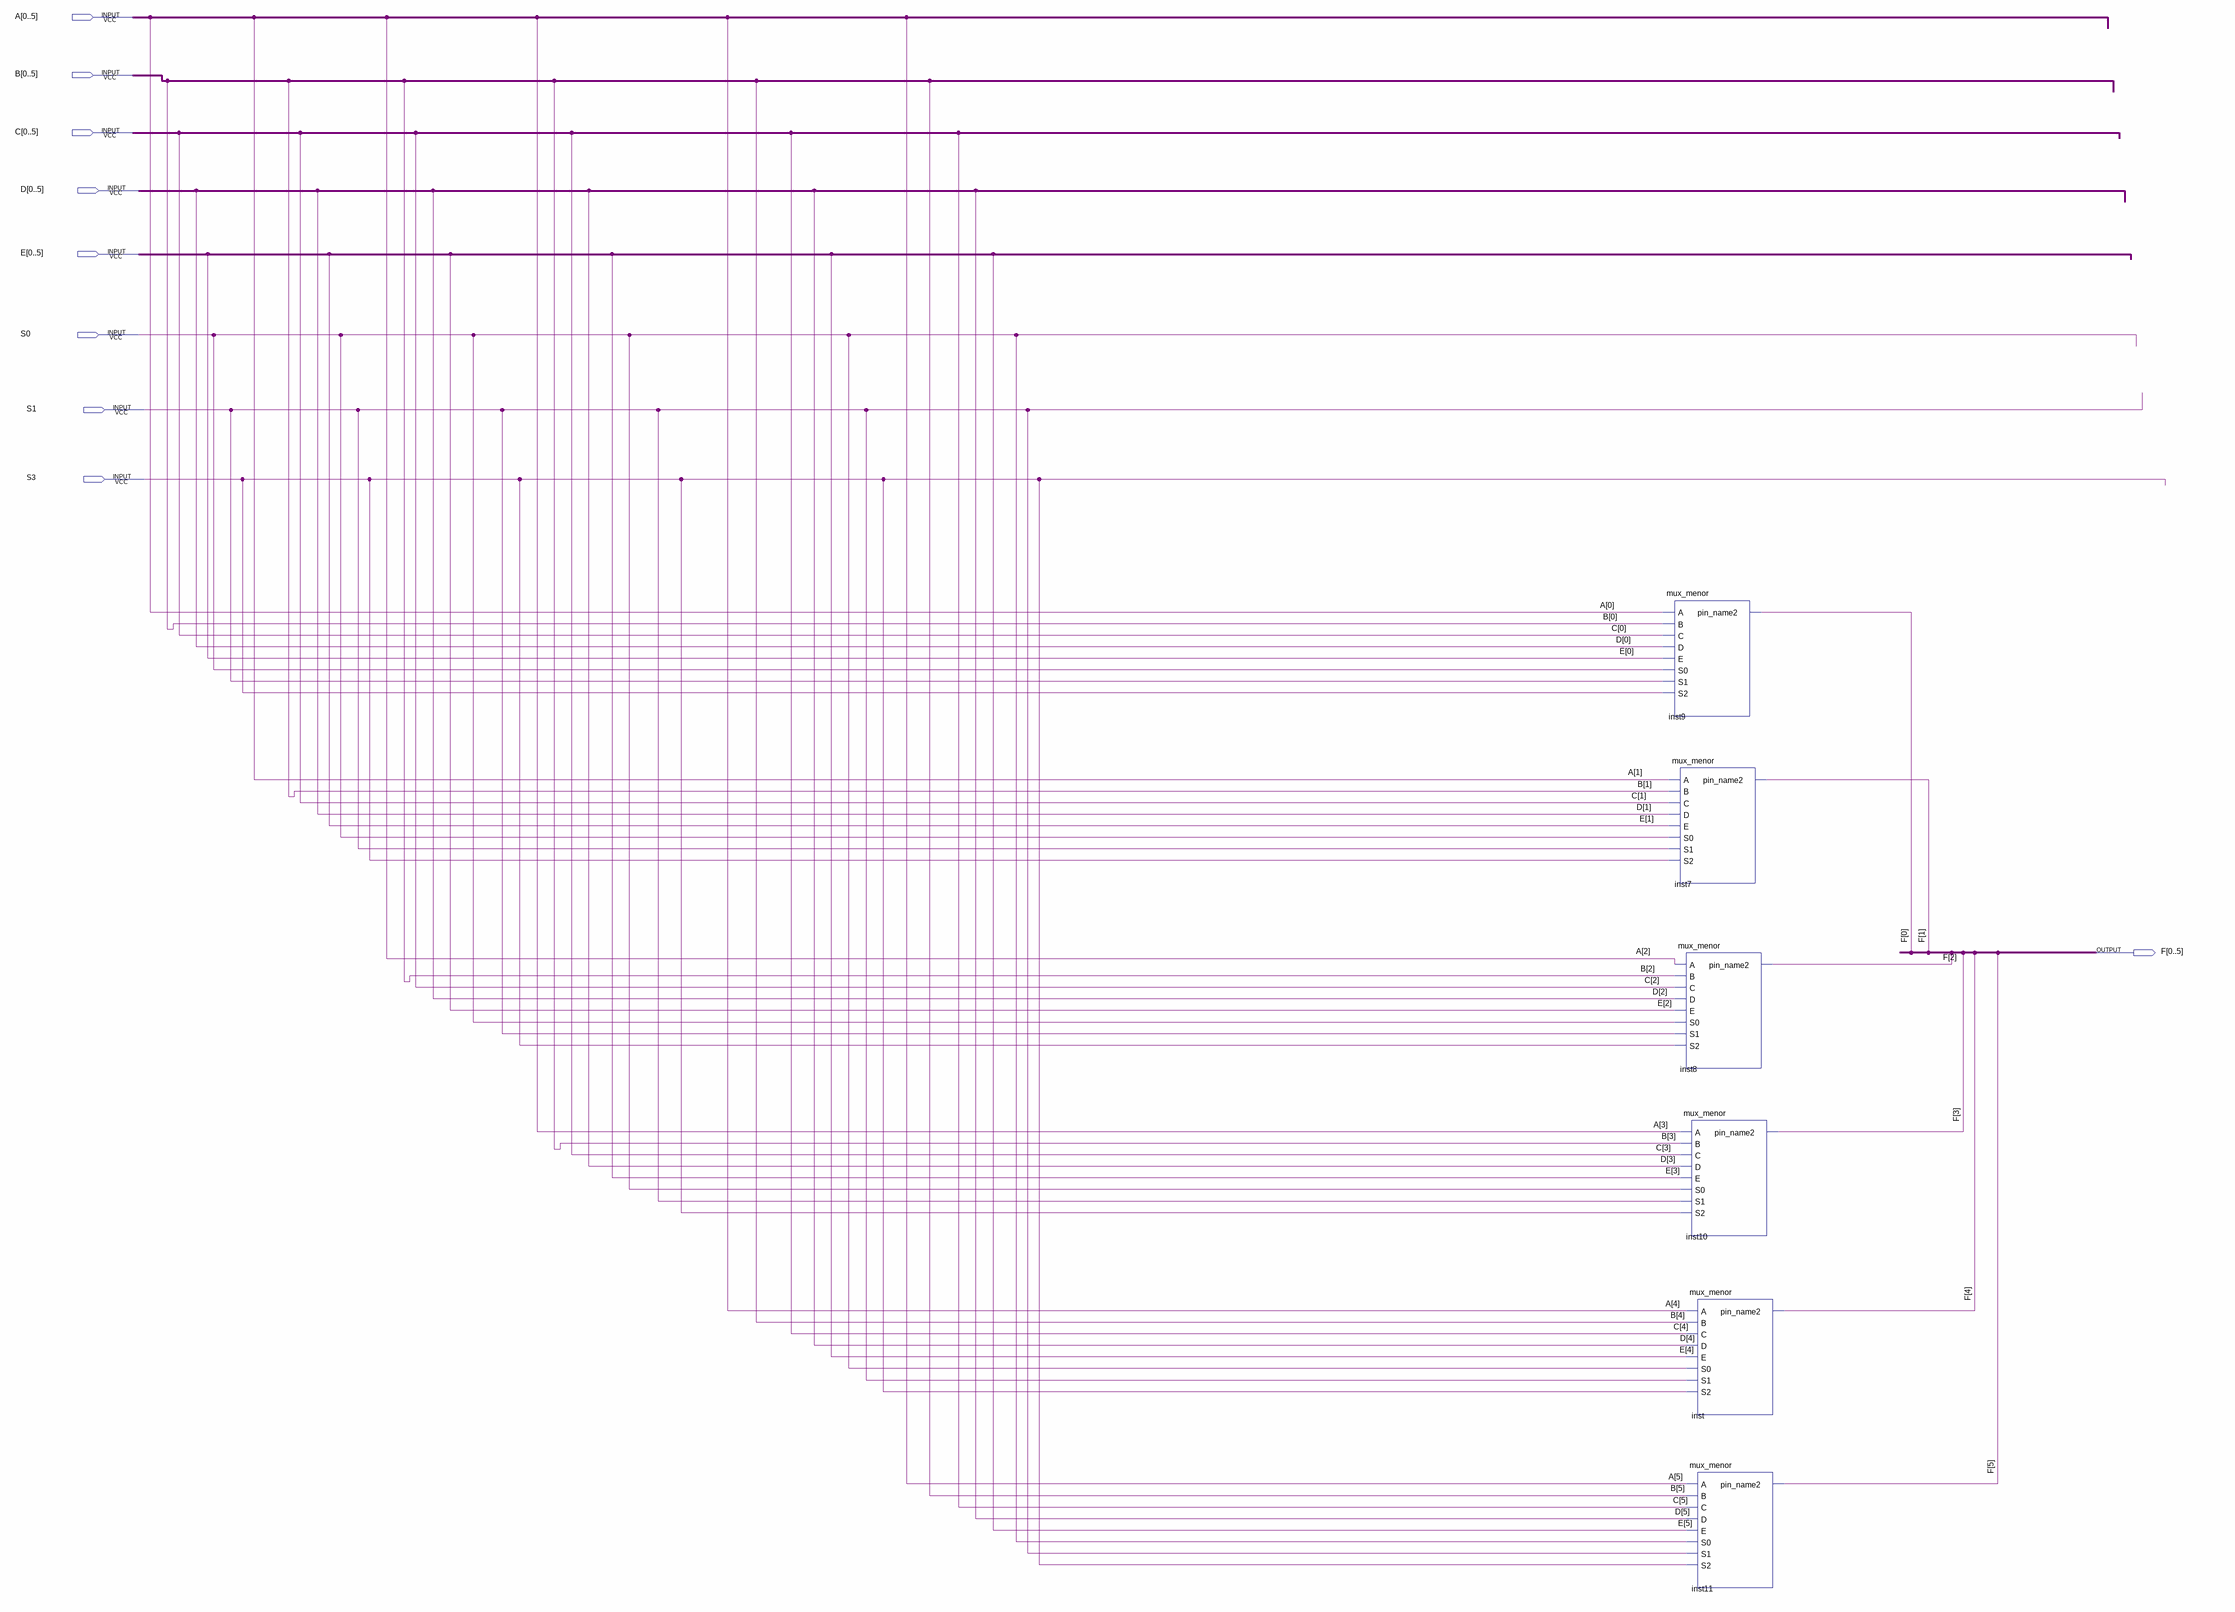
[diagram p0: schematic sheet]
// Quartus schematic MUX_FINAL.bdf as structural Verilog: 6 symbols, 9 pins
module MUX_FINAL (
  input  [0:5] A,
  input  [0:5] B,
  input  [0:5] C,
  input  [0:5] D,
  input  [0:5] E,
  input  S0,
  input  S1,
  input  S3,
  output [0:5] F
);

  mux_menor inst9 (.A(A[0]), .B(B[0]), .C(C[0]), .D(D[0]), .E(E[0]), .S0(S0), .S1(S1), .S2(S3), .pin_name2(F[0]));
  mux_menor inst7 (.A(A[1]), .B(B[1]), .C(C[1]), .D(D[1]), .E(E[1]), .S0(S0), .S1(S1), .S2(S3), .pin_name2(F[1]));
  mux_menor inst8 (.A(A[2]), .B(B[2]), .C(C[2]), .D(D[2]), .E(E[2]), .S0(S0), .S1(S1), .S2(S3), .pin_name2(F[2]));
  mux_menor inst10 (.A(A[3]), .B(B[3]), .C(C[3]), .D(D[3]), .E(E[3]), .S0(S0), .S1(S1), .S2(S3), .pin_name2(F[3]));
  mux_menor inst (.A(A[4]), .B(B[4]), .C(C[4]), .D(D[4]), .E(E[4]), .S0(S0), .S1(S1), .S2(S3), .pin_name2(F[4]));
  mux_menor inst11 (.A(A[5]), .B(B[5]), .C(C[5]), .D(D[5]), .E(E[5]), .S0(S0), .S1(S1), .S2(S3), .pin_name2(F[5]));
endmodule
